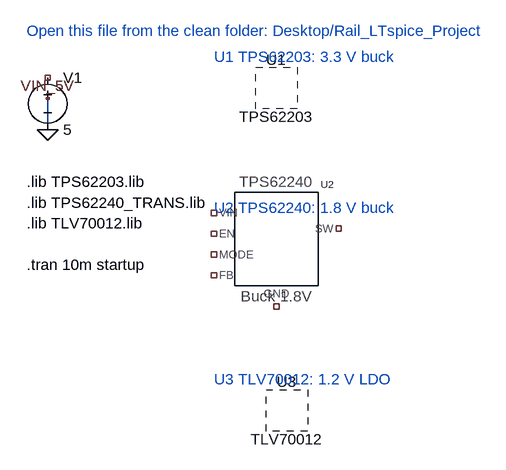
[diagram p0: schematic PowerRails_REAL_clean.asc]
PowerRails_REAL_clean.asc, the LTspice schematic file:
Version 4.1
SHEET 1 1400 900
WIRE 64 80 64 128
FLAG 64 128 0
FLAG 64 80 VIN_5V
SYMBOL voltage 64 32 R0
WINDOW 123 0 0 Left 0
WINDOW 39 0 0 Left 0
SYMATTR InstName V1
SYMATTR Value 5
SYMBOL TPS62203 416 64 R0
SYMATTR InstName U1
SYMBOL TPS62240_TRANS 416 296 R0
SYMATTR InstName U2
SYMBOL TLV70012 432 560 R0
SYMATTR InstName U3
TEXT 32 -24 Left 2 ;Open this file from the clean folder: Desktop/Rail_LTspice_Project
TEXT 32 208 Left 2 !.lib TPS62203.lib
TEXT 32 240 Left 2 !.lib TPS62240_TRANS.lib
TEXT 32 272 Left 2 !.lib TLV70012.lib
TEXT 32 336 Left 2 !.tran 10m startup
TEXT 320 16 Left 2 ;U1 TPS62203: 3.3 V buck
TEXT 320 248 Left 2 ;U2 TPS62240: 1.8 V buck
TEXT 320 512 Left 2 ;U3 TLV70012: 1.2 V LDO

The netlist it stands for:
* PowerRails_REAL_clean.asc
V1 NC_01 0 5
* U1: TPS62203 (symbol TPS62203 not available, pin order unknown); nets seen at it: 
X§U2 NC_02 NC_03 NC_04 NC_05 NC_06 NC_07 TPS62240_TRANS  ; pins SW MODE FB EN VIN GND
* U3: TLV70012 (symbol TLV70012 not available, pin order unknown); nets seen at it: 
* Open this file from the clean folder: Desktop/Rail_LTspice_Project
.lib TPS62203.lib
.lib TPS62240_TRANS.lib
.lib TLV70012.lib
.tran 10m startup
* U1 TPS62203: 3.3 V buck
* U2 TPS62240: 1.8 V buck
* U3 TLV70012: 1.2 V LDO
.backanno
.end